# EAGLE design ESC-simple_V2A[ervinedit] (EAGLE 8.6.3)
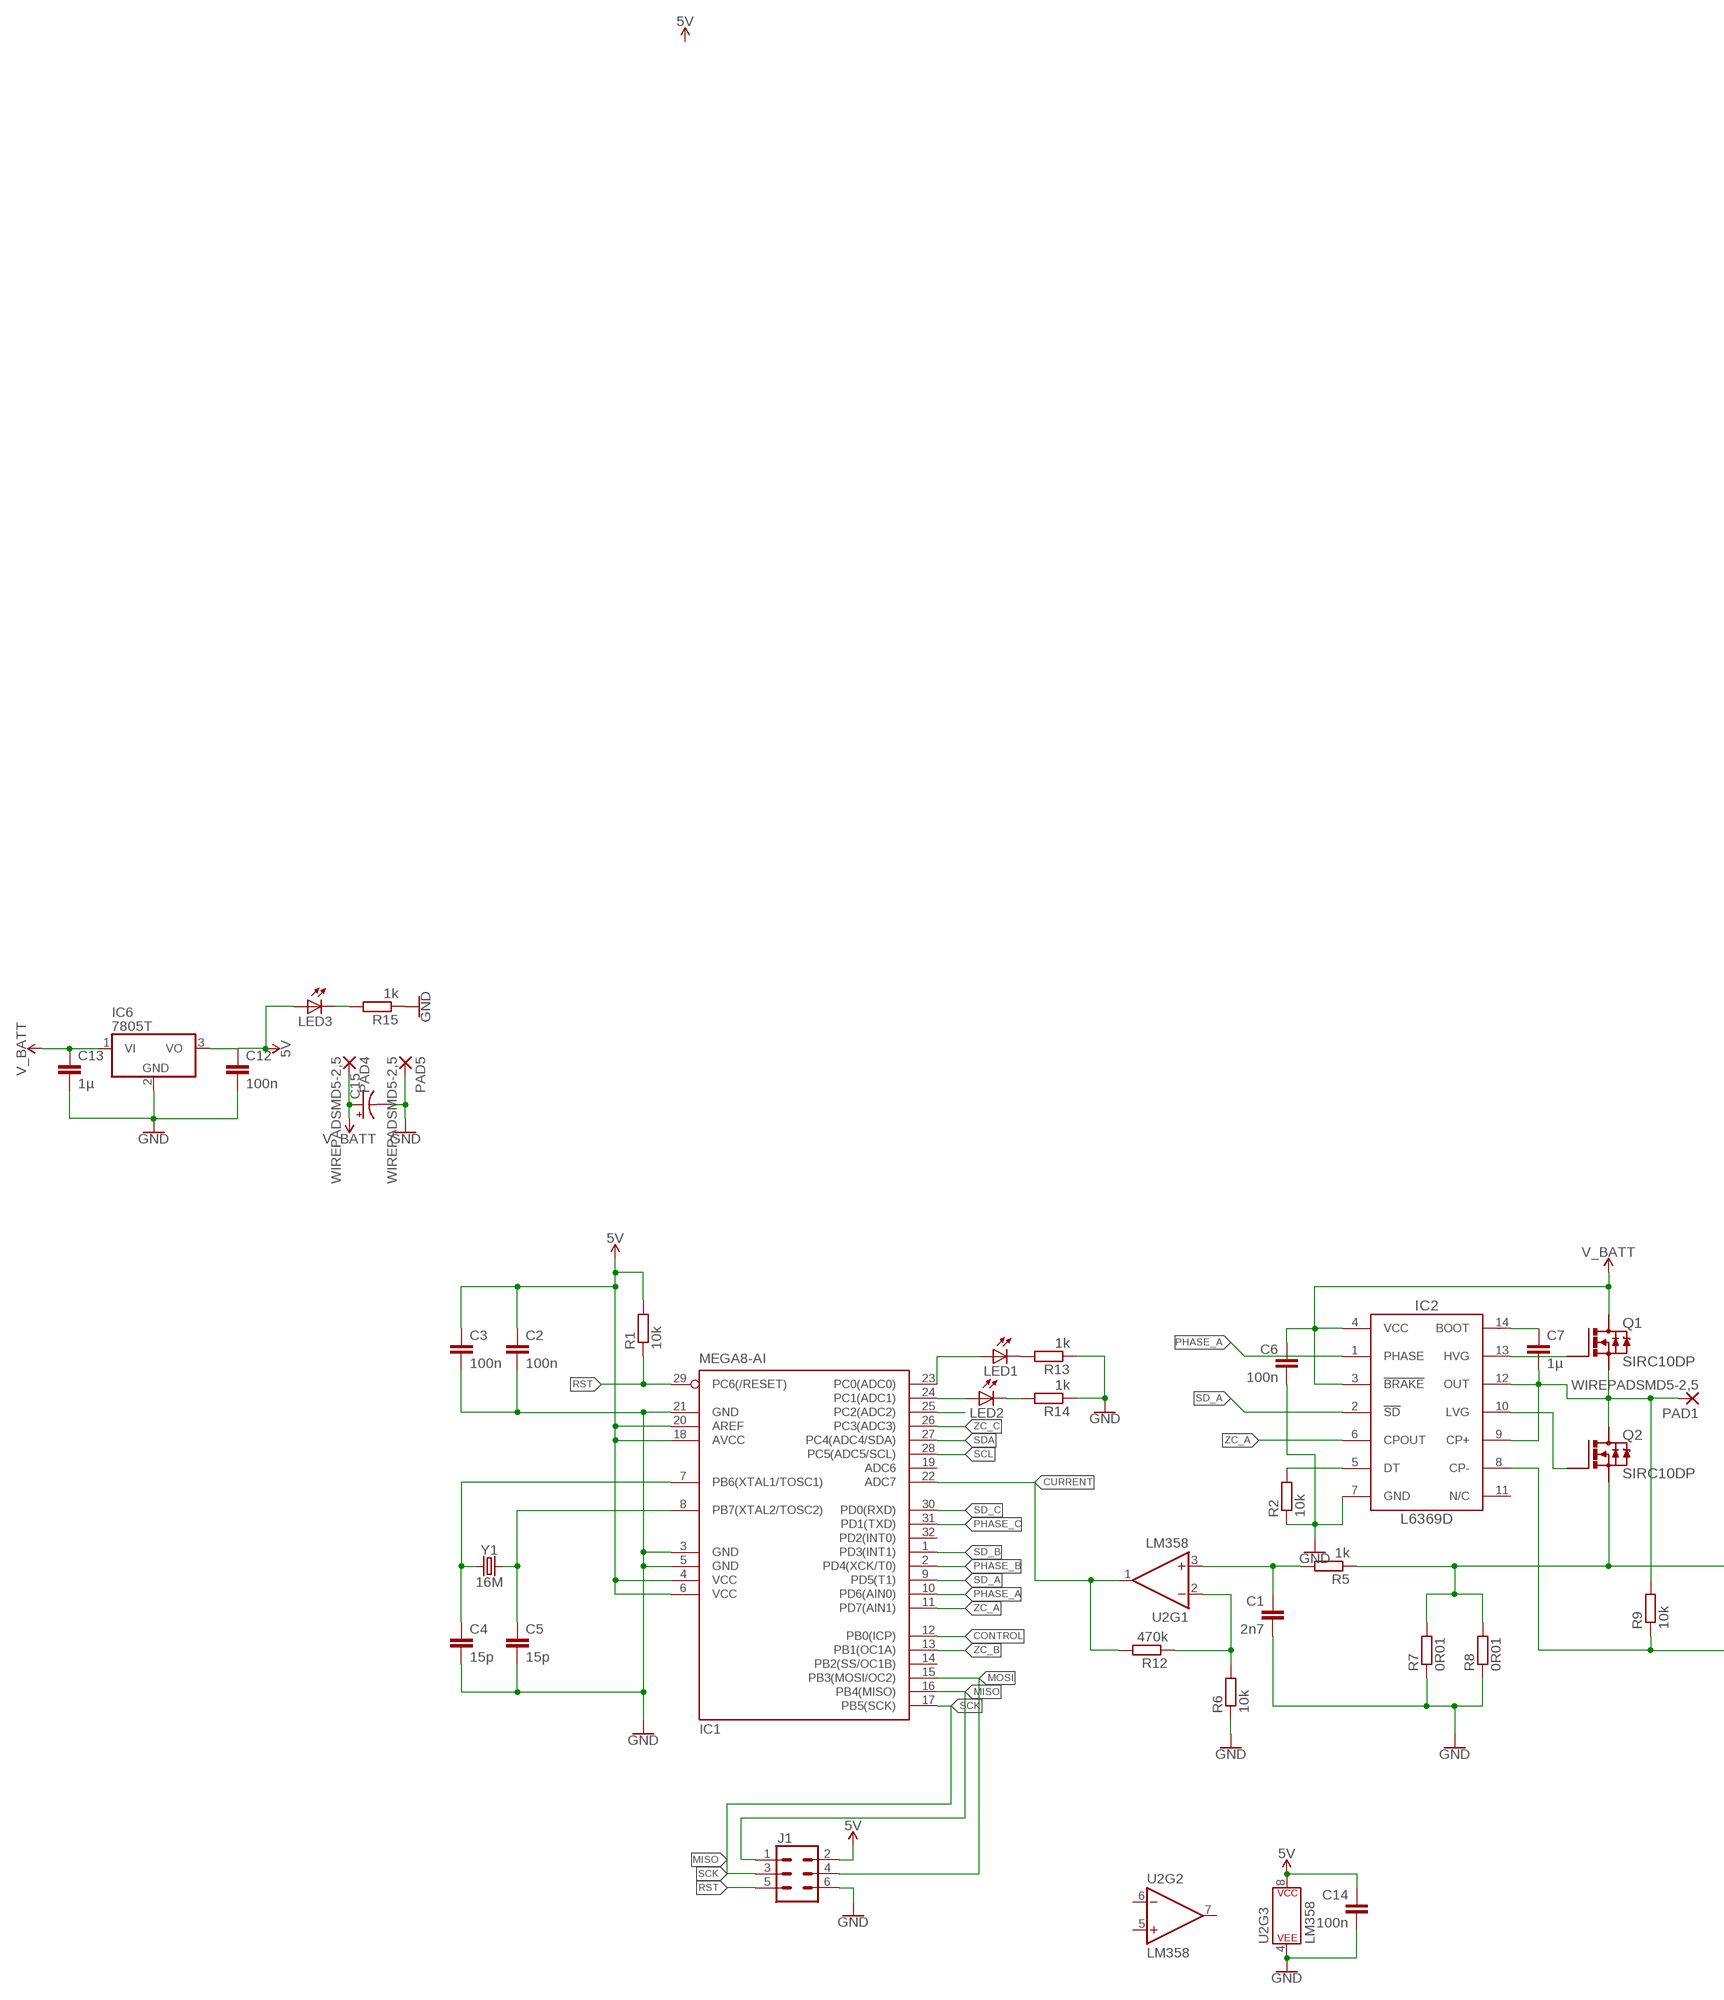
[diagram p0: schematic, sheet 1, part 1 of 2]
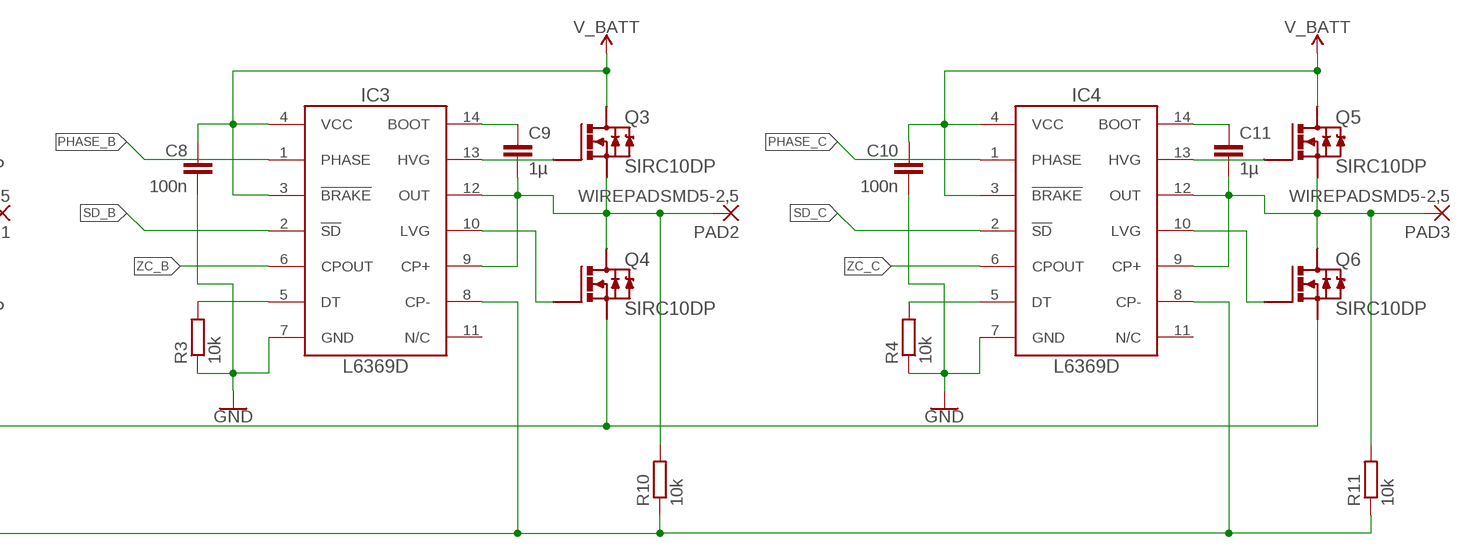
[diagram p1: schematic, sheet 1, part 2 of 2]

## Parts
C1  2n7  C-EUC1206K  [C1206K]
C2  100n  C-EUC1206K  [C1206K]
C3  100n  C-EUC1206K  [C1206K]
C4  15p  C-EUC1206K  [C1206K]
C5  15p  C-EUC1206K  [C1206K]
C6  100n  C-EUC1206K  [C1206K]
C7  1µ  C-EUC1206K  [C1206K]
C8  100n  C-EUC1206K  [C1206K]
C9  1µ  C-EUC1206K  [C1206K]
C10  100n  C-EUC1206K  [C1206K]
C11  1µ  C-EUC1206K  [C1206K]
C12  100n  C-EUC1206K  [C1206K]
C13  1µ  C-EUC1206K  [C1206K]
C14  100n  C-EUC1206K  [C1206K]
C15  CPOL-USE5-13  [E5-13]
IC1  MEGA8-AI  [TQFP32-08]
IC2  L6369D  [SO-14]
IC3  L6369D  [SO-14]
IC4  L6369D  [SO-14]
IC6  7805T  [TO220H]
J1  CONN_03X22X3_SILK_MALE_PTH  [2X3]
LED1  TLLR4400  [LED3MM]
LED2  TLLR4400  [LED3MM]
LED3  TLLR4400  [LED3MM]
PAD1  WIREPADSMD5-2,5  [5-2,5]
PAD2  WIREPADSMD5-2,5  [5-2,5]
PAD3  WIREPADSMD5-2,5  [5-2,5]
PAD4  WIREPADSMD5-2,5  [5-2,5]
PAD5  WIREPADSMD5-2,5  [5-2,5]
Q1  SIRC10DP  [POWERPAK_SO-8_SINGLE]
Q2  SIRC10DP  [POWERPAK_SO-8_SINGLE]
Q3  SIRC10DP  [POWERPAK_SO-8_SINGLE]
Q4  SIRC10DP  [POWERPAK_SO-8_SINGLE]
Q5  SIRC10DP  [POWERPAK_SO-8_SINGLE]
Q6  SIRC10DP  [POWERPAK_SO-8_SINGLE]
R1  10k  R-EU_R1206  [R1206]
R2  10k  R-EU_R1206  [R1206]
R3  10k  R-EU_R1206  [R1206]
R4  10k  R-EU_R1206  [R1206]
R5  1k  R-EU_R1206  [R1206]
R6  10k  R-EU_R1206  [R1206]
R7  0R01  R-EU_R1206  [R1206]
R8  0R01  R-EU_R1206  [R1206]
R9  10k  R-EU_R1206  [R1206]
R10  10k  R-EU_R1206  [R1206]
R11  10k  R-EU_R1206  [R1206]
R12  470k  R-EU_R1206  [R1206]
R13  1k  R-EU_R1206  [R1206]
R14  1k  R-EU_R1206  [R1206]
R15  1k  R-EU_R1206  [R1206]
U2  LM358  [DIP08]
Y1  16M  CRYSTALSMD-HC49UP  [HC49UP]

## Nets
5V [power]: C2.1 C3.1 C12.1 C14.1 IC1.4(VCC) IC1.6(VCC) IC1.18(AVCC) IC1.20(AREF) IC6.3(VO) J1.2 LED3.A R1.2 U2.8(P$V+)
A: C7.2 IC2.9(CP+) IC2.12(OUT) PAD1.1(P) Q1.1(S) Q1.2(S) Q1.3(S) Q2.5(D) Q2.6(D) Q2.7(D) Q2.8(D) Q2.9(D) R9.2
B: C9.2 IC3.9(CP+) IC3.12(OUT) PAD2.1(P) Q3.1(S) Q3.2(S) Q3.3(S) Q4.5(D) Q4.6(D) Q4.7(D) Q4.8(D) Q4.9(D) R10.2
C: C11.2 IC4.9(CP+) IC4.12(OUT) PAD3.1(P) Q5.1(S) Q5.2(S) Q5.3(S) Q6.5(D) Q6.6(D) Q6.7(D) Q6.8(D) Q6.9(D) R11.2
CONTROL: IC1.12(PB0(ICP))
CURRENT: IC1.22(ADC7) R12.2 U2.1(OUT)
CURRENT_SENSE: Q2.1(S) Q2.2(S) Q2.3(S) Q4.1(S) Q4.2(S) Q4.3(S) Q6.1(S) Q6.2(S) Q6.3(S) R5.1 R7.2 R8.2
GND: C1.2 C2.2 C3.2 C4.2 C5.2 C6.2 C8.2 C10.2 C12.2 C13.2 C14.2 C15.- IC1.3(GND) IC1.5(GND) IC1.21(GND) IC2.7(GND) IC3.7(GND) IC4.7(GND) IC6.2(GND) J1.6 PAD5.1(P) R2.1 R3.1 R4.1 R6.1 R7.1 R8.1 R13.1 R14.1 R15.1 U2.4(P$V-)
MISO: IC1.16(PB4(MISO)) J1.1
MOSI: IC1.15(PB3(MOSI/OC2)) J1.4
N$1: C7.1 IC2.14(BOOT)
N$2: IC2.13(HVG) Q1.4(G)
N$3: IC2.10(LVG) Q2.4(G)
N$4: IC3.5(DT) R3.2
N$5: IC2.5(DT) R2.2
N$6: C9.1 IC3.14(BOOT)
N$7: IC3.13(HVG) Q3.4(G)
N$8: IC3.10(LVG) Q4.4(G)
N$9: R6.2 R12.1 U2.2(-IN)
N$10: IC4.5(DT) R4.2
N$11: C11.1 IC4.14(BOOT)
N$12: IC4.13(HVG) Q5.4(G)
N$13: IC4.10(LVG) Q6.4(G)
N$14: LED1.K(C) R13.2
N$15: IC1.24(PC1(ADC1)) LED2.A
N$16: LED2.K(C) R14.2
N$17: IC1.23(PC0(ADC0)) LED1.A
N$18: LED3.K(C) R15.2
N$20: C1.1 R5.2 U2.3(+IN)
PC2: IC1.25(PC2(ADC2))
PHASE_A: IC1.10(PD6(AIN0)) IC2.1(PHASE)
PHASE_B: IC1.2(PD4(XCK/T0)) IC3.1(PHASE)
PHASE_C: IC1.31(PD1(TXD)) IC4.1(PHASE)
RST: IC1.29(PC6(/RESET)) J1.5 R1.1
SCK: IC1.17(PB5(SCK)) J1.3
SCL: IC1.28(PC5(ADC5/SCL))
SD_A: IC1.9(PD5(T1)) IC2.2(!SD)
SD_B: IC1.1(PD3(INT1)) IC3.2(!SD)
SD_C: IC1.30(PD0(RXD)) IC4.2(!SD)
SDA: IC1.27(PC4(ADC4/SDA))
V_BATT [power]: C6.1 C8.1 C10.1 C13.1 C15.+ IC2.3(!BRAKE) IC2.4(VCC) IC3.3(!BRAKE) IC3.4(VCC) IC4.3(!BRAKE) IC4.4(VCC) IC6.1(VI) PAD4.1(P) Q1.5(D) Q1.6(D) Q1.7(D) Q1.8(D) Q1.9(D) Q3.5(D) Q3.6(D) Q3.7(D) Q3.8(D) Q3.9(D) Q5.5(D) Q5.6(D) Q5.7(D) Q5.8(D) Q5.9(D)
V_NEUTRAL: IC2.8(CP-) IC3.8(CP-) IC4.8(CP-) R9.1 R10.1 R11.1
XTAL1: C4.1 IC1.7(PB6(XTAL1/TOSC1)) Y1.1
XTAL2: C5.1 IC1.8(PB7(XTAL2/TOSC2)) Y1.2
ZC_A: IC1.11(PD7(AIN1)) IC2.6(CPOUT)
ZC_B: IC1.13(PB1(OC1A)) IC3.6(CPOUT)
ZC_C: IC1.26(PC3(ADC3)) IC4.6(CPOUT)
Unconnected: IC1.14(PB2(SS/OC1B)) IC1.19(ADC6) IC1.32(PD2(INT0)) IC2.11(N/C) IC3.11(N/C) IC4.11(N/C) U2.5(+IN) U2.6(-IN) U2.7(OUT)

## Library data of the parts
C1-C14 = rcl:C-EU: CAPACITOR, European symbol; SPICEPREFIX: C
C15 = rcl:CPOL-US: POLARIZED CAPACITOR, American symbol; SPICEPREFIX: C
IC1 = atmel:MEGA8: MICROCONTROLLER 8 Kbytes FLASH, 1 kbytes SRAM, 512 bytes EEPROM, USART, 6-channel 10 bit ADC, 2-channel 8 bit ADC Pin compatible with Atmega48, ATMega88, ATMega168 Source: avr.lbr; MPN: ATMEGA8-16AU; OC_FARNELL: 9171371; OC_NEWARK: 73M8863
IC2-IC4 = custom-ics:L6369
IC6 = linear:78*: Positive VOLTAGE REGULATOR Source: http://cache.national.com/ds/LM/LM78L05.pdf http://www.fairchildsemi.com/ds/LM/LM7805.pdf
J1 = SparkFun-Connectors:CONN_03X2: Multi connection point. Often used as Generic Header-pin footprint for 0.1 inch spaced/style header connections You can populate with any combo of single row headers, but if you'd like an exact match, check these: Header - 2x3 (Male, 0.1") <https://www.sparkfun.com/products/12807> (PRT-12807) Header - 2x3 (Female, 0.1") <https://www.sparkfun.com/products/13010> (PRT-13010) 2x3 Pin Shrouded Header <https://www.sparkfun.com/products/10877> (PRT-10877) On any of the 0.1 inch spaced packages, you can populate with these: Break Away Headers - Straight <https://www.sparkfun.com/products/116> (PRT-00116) Break Away Male Headers - Right Angle <https://www.sparkfun.com/products/553> (PRT-00553) Female Headers <https://www.sparkfun.com/products/115> (PRT-00115) Break Away Headers - Machine Pin <https://www.sparkfun.com/products/117> (PRT-00117) Break Away Female Headers - Swiss Machine Pin <https://www.sparkfun.com/products/743> (PRT-00743) Special note: the shrouded connector mates well with our 3x2 ribbon cables: Ribbon Crimp Connector - 6-pin (2x3, Female) <https://www.sparkfun.com/products/10651> (PRT-10651) Ribbon Cable - 6 wire (15ft) <https://www.sparkfun.com/products/10646> (PRT-10646); PROD_ID: CONN-09701
LED1-LED3 = led:TLLR4400: Low Current (2mA) LED 3 mm Tinted Diffused Package color RED Source: Data sheet <http://www.farnell.com/datasheets/391100.pdf>; MF: VISHAY SEMICONDUCTOR; OC_FARNELL: 1612437
PAD1-PAD5 = wirepad:WIREPAD: Wire PAD connect wire on PCB
Q1-Q6 = MOSFET:SIRC10DP: N-Channel 30 V (D-S) MOSFET with Schottky Diode Datasheet <https://www.vishay.com/docs/75189/sirc10dp.pdf>
R1-R15 = rcl:R-EU_: RESISTOR, European symbol; SPICEPREFIX: R
U2 = SparkFun-IC-Amplifiers:LM358: LM358 Jellybean op-amp Datasheet <http://www.sparkfun.com/datasheets/Components/General/LM358.pdf> SparkFun Products Op-Amp (Thru-Hole) - LM358 <https://www.sparkfun.com/products/9456> (COM-09456); PROD_ID: IC-09172
Y1 = SparkFun-Clocks:CRYSTAL: Crystals (Generic) These are passive quartz crystals, which can be used as a clock source for a microcontroller. Crystal's are two-terminal devices. They require external "load" capacitors to generate an oscillating signal.

## Net classes
0 default: width 0.305 mm, clearance 0.305 mm
1 power: width 0.305 mm, clearance 0.305 mm

## Board
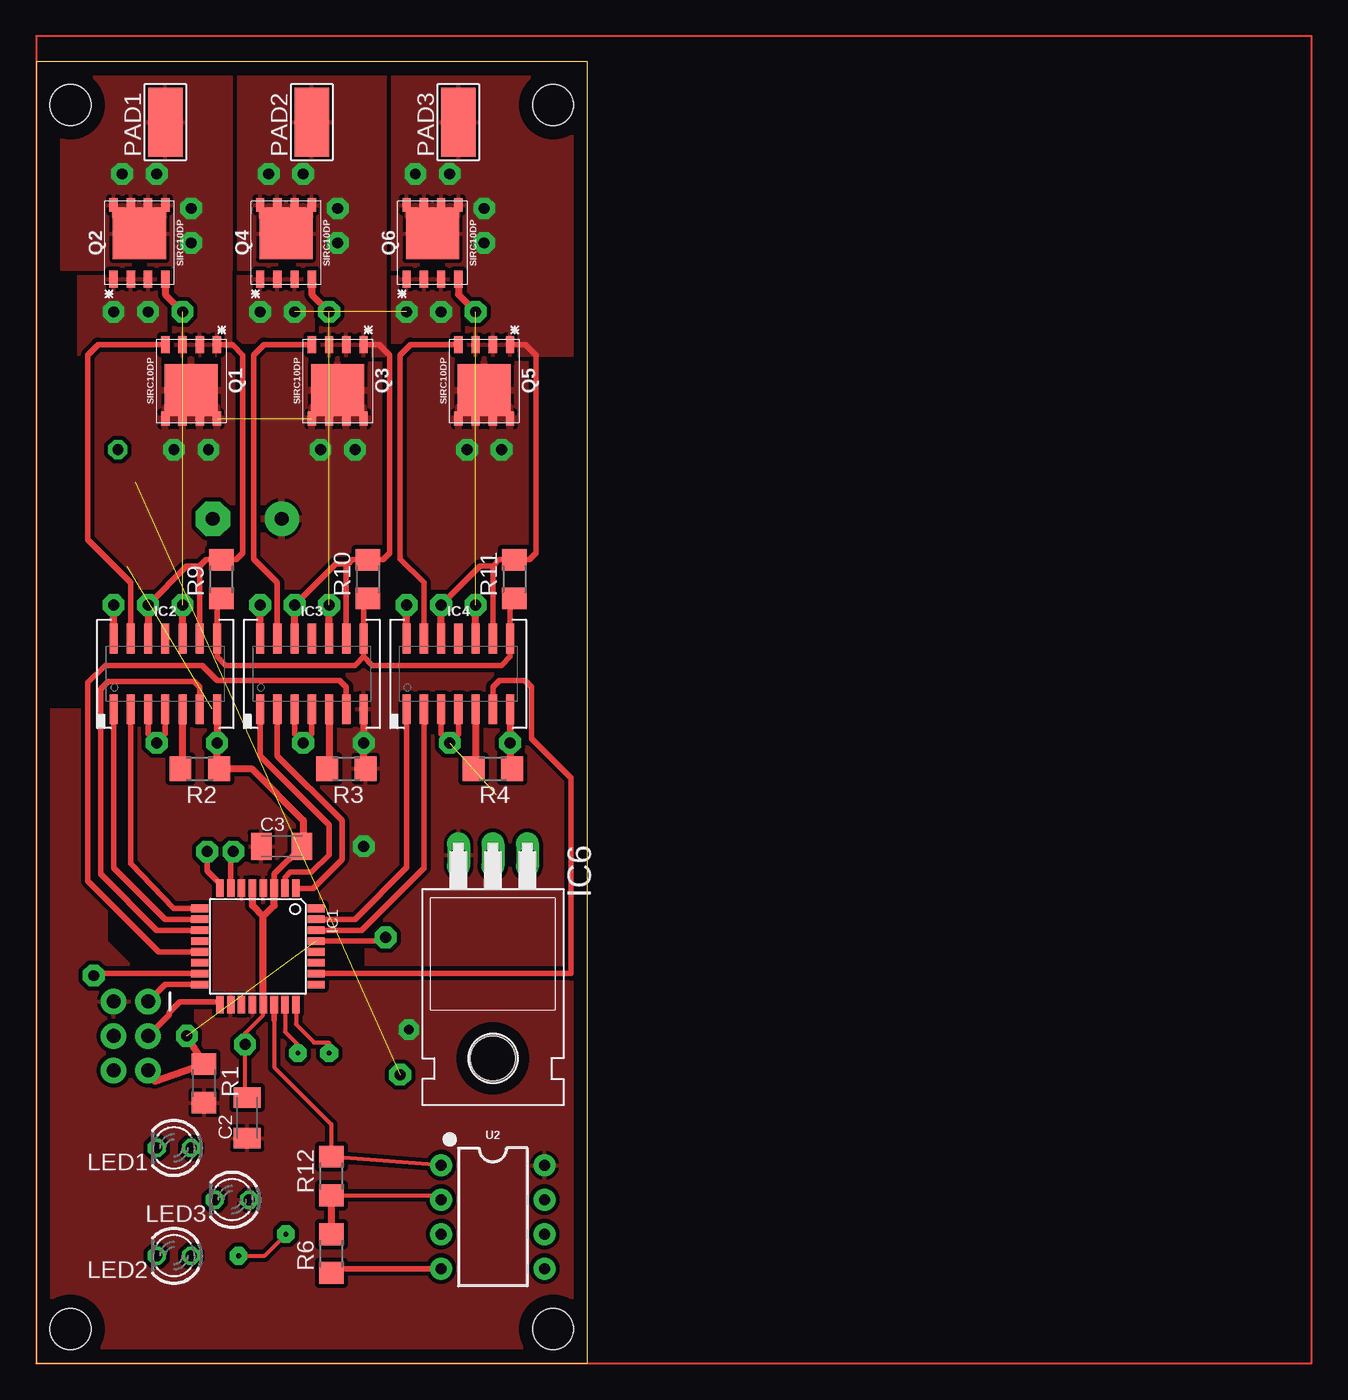
[diagram p2: board, top side]
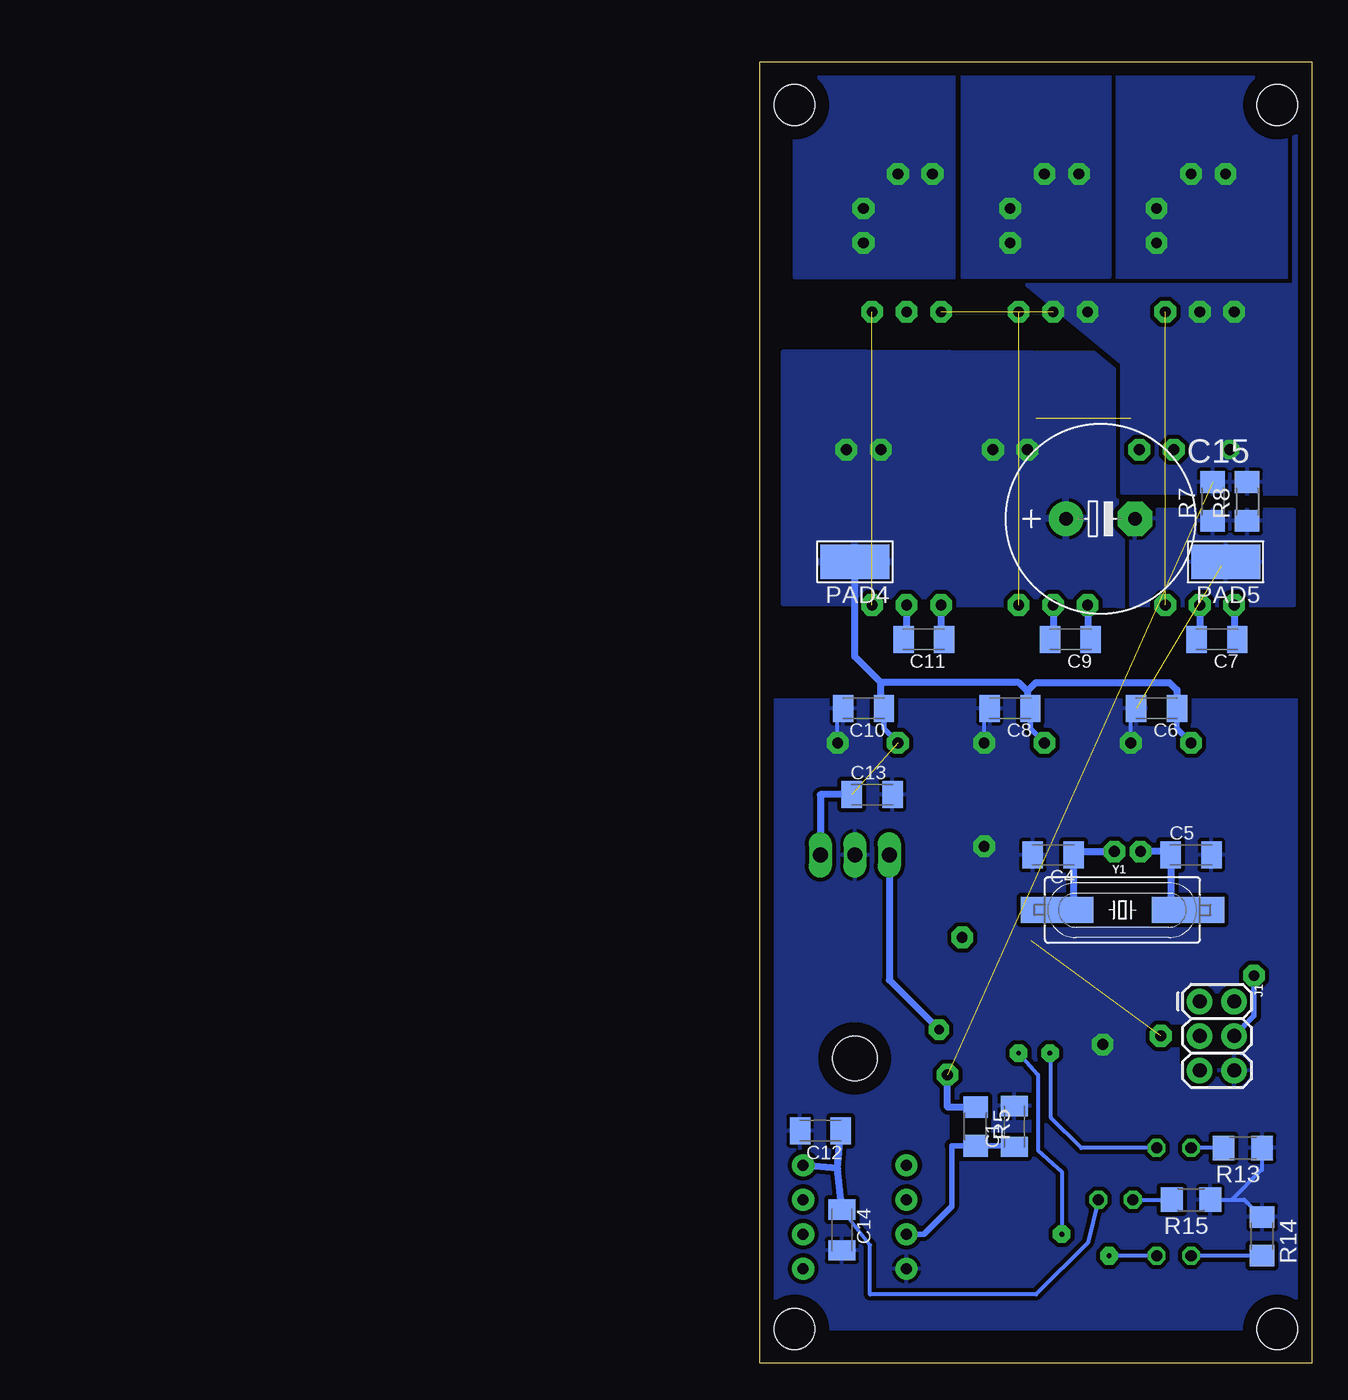
[diagram p3: board, bottom side, seen from below]

Size 40.64 x 95.89 mm. Coordinates in mm from the lower left corner, seen from the top.
Outline: 0,0 40.64,0 40.64,95.89 0,95.89 0,0
Copper layers (1*16): Top 0.035mm / dielectric 1.5mm / Bottom 0.035mm
Design rules "default": minimum track width 6mil, minimum drill 0.35mm, track to track 6mil, track to pad 6mil, pad to pad 6mil, via to via 6mil, smd to smd 6mil, copper to edge 40mil, drill to drill 6mil, minimum pad ring 10mil, minimum via ring 8mil, stop-mask expansion 4mil, vias tented up to drill 0mil, thermal gap 10mil
Holes 3 mm at 2.54,2.54 38.1,2.54 2.54,92.71 38.1,92.71
tRestrict: area 7.6,25.4 to 11.4,26.7; area 6.3,55.9 to 11.4,56.5; area 28.4,80.5 to 29.8,81.3; area 17.9,80.6 to 19.1,81.3; area 7.1,80.6 to 8.1,81.3; area 5.4,29.1 to 11.3,33.3; area 21.6,29.2 to 24.1,30.5; area 5.2,27.1 to 7.5,28.1
bRestrict: area 6.3,23.5 to 10.2,24.8; area 7.6,22.2 to 9.5,23.5; area 10.8,47 to 12.1,49.5; area 10.8,32.2 to 17.6,37.3; area 24.1,17 to 26.7,17.8; area 23.7,17 to 24.3,17.9; area 25.9,16.4 to 26.7,18.4; area 23,14.9 to 23.8,15.4; area 23,16.4 to 23.7,17

### Footprints (pad centres in the part's own frame; a part is rotated, then mirrored left to right if it is on the bottom)
C1206K = smd 1.5 x 2: 1 -1.5,0; 2 1.5,0
E5-13 = drill 1.016 pad 2.54: + -2.54,0 | drill 1.016 pad 2.54 octagon: - 2.54,0
TQFP32-08 = smd 1.27 x 0.559: 1 -4.293,2.8; 2 -4.293,2; 3 -4.293,1.2; 4 -4.293,0.4; 5 -4.293,-0.4; 6 -4.293,-1.2; 7 -4.293,-2; 8 -4.293,-2.8; 17 4.293,-2.8; 18 4.293,-2; 19 4.293,-1.2; 20 4.293,-0.4; 21 4.293,0.4; 22 4.293,1.2; 23 4.293,2; 24 4.293,2.8 | smd 0.559 x 1.27: 9 -2.8,-4.293; 10 -2,-4.293; 11 -1.2,-4.293; 12 -0.4,-4.293; 13 0.4,-4.293; 14 1.2,-4.293; 15 2,-4.293; 16 2.8,-4.293; 25 2.8,4.293; 26 2,4.293; 27 1.2,4.293; 28 0.4,4.293; 29 -0.4,4.293; 30 -1.2,4.293; 31 -2,4.293; 32 -2.8,4.293
SO-14 = smd 0.6 x 2.2: 1 -3.81,-2.6; 2 -2.54,-2.6; 3 -1.27,-2.6; 4 0,-2.6; 5 1.27,-2.6; 6 2.54,-2.6; 7 3.81,-2.6; 8 3.81,2.6; 9 2.54,2.6; 10 1.27,2.6; 11 0,2.6; 12 -1.27,2.6; 13 -2.54,2.6; 14 -3.81,2.6
TO220H = drill 1.118 long: 1 -2.54,-10.16; 2 0,-10.16; 3 2.54,-10.16 | hole 3.302: 0,4.826
2X3 = drill 1.016 pad 1.88: 1 0,0; 2 0,2.54; 3 2.54,0; 4 2.54,2.54; 5 5.08,0; 6 5.08,2.54
LED3MM = drill 0.813 octagon: A -1.27,0; K 1.27,0
5-2,5 = smd 2.54 x 5.08: 1 0,0
POWERPAK_SO-8_SINGLE = smd 1.27 x 0.61: 1 -2.67,1.905; 2 -2.67,0.635; 3 -2.67,-0.635; 4 -2.67,-1.905 | smd 1.02 x 0.61: 5 2.795,-1.905; 6 2.795,-0.635; 7 2.795,0.635; 8 2.795,1.905 | smd 3.81 x 3.91: 9 0.69,0
R1206 = smd 1.6 x 1.803: 1 -1.422,0; 2 1.422,0
DIP08 = drill 0.813 pad 1.626: 1 -3.81,-3.81; 2 -1.27,-3.81; 3 1.27,-3.81; 4 3.81,-3.81; 5 3.81,3.81; 6 1.27,3.81; 7 -1.27,3.81; 8 -3.81,3.81
HC49UP = smd 5.334 x 1.93: 1 -4.826,0; 2 4.826,0

### Placement (x,y rotation side)
C1  21.91,17.46 90 bottom
C2  15.56,18.1 90 top
C3  18.1,38.1 0 top
C4  19.05,37.47 180 bottom
C5  8.89,37.47 0 bottom
C6  11.43,48.26 180 bottom
C7  6.98,53.34 180 bottom
C8  22.23,48.26 180 bottom
C9  17.78,53.34 180 bottom
C10  33.02,48.26 180 bottom
C11  28.57,53.34 180 bottom
C12  36.2,17.14 180 bottom
C13  32.38,41.91 0 bottom
C14  34.61,9.84 270 bottom
C15  15.56,62.23 0 bottom
IC1  16.35,30.72 270 top
IC2  9.53,50.8 0 top
IC3  20.32,50.8 0 top
IC4  31.11,50.8 0 top
IC6  33.66,27.3 180 top
J1  8.25,26.67 270 bottom
LED1  10.16,15.88 180 top
LED2  10.16,7.94 180 top
LED3  14.45,12.06 180 top
PAD1  9.53,91.44 0 top
PAD2  20.32,91.44 0 top
PAD3  31.11,91.44 0 top
PAD4  33.66,59.05 90 bottom
PAD5  6.35,59.05 90 bottom
Q1  11.43,72.39 270 top
Q2  7.62,82.55 90 top
Q3  22.23,72.39 270 top
Q4  18.42,82.55 90 top
Q5  33.02,72.39 270 top
Q6  29.21,82.55 90 top
R1  12.38,20.64 270 top
R2  12.06,43.81 180 top
R3  22.86,43.81 180 top
R4  33.66,43.81 180 top
R5  24.77,17.46 270 bottom
R6  21.75,8.1 90 top
R7  7.3,63.5 90 bottom
R8  4.76,63.5 90 bottom
R9  13.65,57.78 90 top
R10  24.45,57.78 90 top
R11  35.24,57.78 90 top
R12  21.75,13.81 90 top
R13  5.08,15.88 180 bottom
R14  3.65,9.37 270 bottom
R15  8.89,12.06 180 bottom
U2  33.66,10.79 270 top
Y1  13.94,33.41 0 bottom

### Tracks (layer width: path | path; a pad name or v marks a point on that pad's centre or on a via)
5V  (via drill 0.7 pad 1.5)
  Bottom 0.305: LED3.A 16.51,8.89 20.32,5.08 32.54,5.08 32.54,8.73 C14.1
  Bottom 0.508: C14.1 34.92,14.38 | 34.92,14.38 U2.8 | 34.92,14.38 C12.1 | IC6.3 31.11,28.26 v27.46,24.61
  pour Top (rank 4): 40,48.26 0.79,48.1 0.64,0.64 40,0.48
A  (via drill 0.8 pad 1.6)
  Top 0.305: Q2.8 5.71,85.14
  Top 0.406: Q1.1 14.47,75.06 15.24,74.3 15.24,59.69 14.76,59.21 R9.2 12.53,59.21 12.06,58.74 | IC2.9 12.06,58.74 | 12.06,58.74 11.11,58.74 v8.25,55.88
  Top 0.508: v8.25,55.88 IC2.12
  Bottom 0.305: 8.25,53.66 C7.2
  Bottom 0.508: v8.25,55.88 8.25,53.66
  other vias: 6.35,87.63 8.89,87.63 11.43,85.09 11.43,82.55
  pour Top (rank 3): 1.9,80.64 15.24,80.64 15.24,96.52 1.9,96.52
  pour Top (rank 3): 10.16,86.36 10.16,74.3 14.6,74.3 14.6,86.36
  pour Bottom (rank 2): 14.29,80.01 14.29,96.52 1.9,96.52 1.9,80.01
B  (via drill 0.8 pad 1.6)
  Top 0.305: Q4.8 16.51,85.14
  Top 0.406: Q3.1 25.27,75.06 26.04,74.3 26.04,59.69 25.55,59.21 R10.2 23.33,59.21 23.02,58.9 | IC3.9 22.86,58.74 23.02,58.9 | 23.02,58.9 22.07,58.9 v19.05,55.88
  Top 0.508: IC3.12 v19.05,55.88
  Bottom 0.305: 19.05,53.66 C9.2
  Bottom 0.508: v19.05,55.88 19.05,53.66
  other vias: 17.14,87.63 19.69,87.63 22.23,85.09 22.23,82.55
  pour Top: 20.96,74.3 25.72,74.3 25.72,96.52 14.92,96.52 14.92,80.64 20.96,80.64
  pour Bottom: 14.92,96.52 14.92,80.01 25.72,80.01 25.72,96.52
C  (via drill 0.8 pad 1.6)
  Top 0.406: Q5.1 36.06,75.06 36.83,74.3 36.83,59.69 36.35,59.21 R11.2 34.12,59.21 33.66,58.74 | IC4.9 33.66,58.74 | 33.66,58.74 32.7,58.74 v29.85,55.88
  Top 0.508: IC4.12 v29.85,55.88
  Bottom 0.305: 29.85,53.66 C11.2
  Bottom 0.508: v29.85,55.88 29.85,53.66
  other vias: 27.94,87.63 30.48,87.63 33.02,85.09 33.02,82.55
  pour Top (rank 3): 24.77,96.52 24.77,80.64 42.54,80.64 42.54,96.52
  pour Top: 31.75,74.3 31.75,86.36 41.91,86.36 41.91,74.3
  pour Bottom (rank 2): 26.35,80.01 26.35,96.52 38.1,96.52 38.1,80.01
CURRENT
  Top 0.305: 17.55,25.4 17.55,21.82 21.75,17.62 R12.2 U2.1
  Top 0.406: IC1.22 17.55,25.4 17.55,25.32
CURRENT_SENSE  (via drill 0.8 pad 1.4, 0.8 pad 1.6)  (2 unrouted)
  Bottom 0.508: R5.1 26.84,18.88 v26.83,21.27
  other vias: 8.25,77.47 19.05,77.47 29.85,77.47 5.71,77.47 16.51,77.47 27.3,77.47 6.03,67.31
  pour Bottom (rank 3): 13.97,64.14 13.97,73.66 40,95.09 -1.91,95.09 -3.02,63.98
  pour Top (rank 2): 14.92,80.64 20.96,80.64 20.96,75.25 14.92,75.25
  pour Top (rank 4): 3.18,80.64 9.53,80.64 9.53,74.3 3.18,74.3
  pour Top (rank 2): 25.4,80.01 31.11,80.01 31.11,75.25 25.4,75.25
GND  (via drill 0.8 pad 1.6)  (1 unrouted)
  Top 0.305: R2.1 13.33,44.13 | R3.1 24.13,44.13 | 34.92,44.13 R4.1 | C2.2 15.4,19.76 v15.4,23.5 15.4,24.32 16.68,25.6 16.68,26.36 IC1.21
  Top 0.406: C3.2 17.55,36.05 IC1.3 | U2.4 21.75,6.99 R6.1
  Top 0.508: IC2.7 v13.33,45.72 13.33,44.13 | IC3.7 v24.13,45.72 24.13,44.13 | IC4.7 v34.92,45.72 34.92,44.13 | IC1.21 16.75,32.94 | IC1.3 17.55,33.74 16.75,32.94 | 16.75,32.94 15.94,33.74 IC1.5 | R2.1 15.87,43.81 19.69,40.01 19.69,38.19 C3.2
  Bottom 0.305: v13.33,45.72 13.33,47.3 C6.2 | v24.13,45.72 24.13,47.3 C8.2 | v34.92,45.72 34.92,47.3 C10.2 | R15.1 5.89,12.06 | 5.89,12.06 3.71,14.25 arc-90 3.66,14.3 R13.1 | 5.89,12.06 4.98,12.06 3.71,10.79 R14.1
  Bottom 0.508: 6.66,58.74 PAD5.1
  other vias: 24.13,38.1
  pour Bottom: 1.27,62.87 13.33,62.87 13.33,55.88 1.27,55.88
  pour Top: 20.96,31.75 24.13,31.75 28.57,36.2 28.57,47.62 29.85,48.9 33.66,48.9 34.92,50.16 34.92,51.44 34.29,52.07 19.05,52.07 20.96,51.44
  pour Bottom: 0,2.54 40.64,2.54 40.64,48.9 0,48.9
MISO
  Top 0.305: IC1.16 12.03,27.94
  Top 0.406: IC1.16 9.5,27.92 J1.1
MOSI  (via drill 0.8 pad 1.6)
  Top 0.406: IC1.15 4.4,28.72 v4.26,28.57
  Bottom 0.406: v4.26,28.57 4.26,25.59 J1.4
N$1  (via drill 0.8 pad 1.6)
  Top 0.508: IC2.14 v5.71,55.88
  Bottom 0.305: 5.71,53.66 C7.1
  Bottom 0.508: v5.71,55.88 5.71,53.66
N$2
  Top 0.406: Q1.4 4.57,75.06 3.81,74.3 3.81,60.69 6.98,57.52 IC2.13
N$3  (via drill 0.8 pad 1.6)  (1 unrouted)
  Top 0.508: IC2.10 v10.79,55.88 | Q2.4 9.53,78.74 v10.79,77.47
N$4
  Top 0.305: 21.59,44.13 R3.2
  Top 0.508: IC3.5 21.59,44.13
N$5
  Top 0.305: R2.2 10.79,44.13
  Top 0.508: 10.79,44.13 IC2.5
N$6  (via drill 0.8 pad 1.6)
  Top 0.508: IC3.14 v16.51,55.88
  Bottom 0.305: 16.51,53.66 C9.1
  Bottom 0.508: v16.51,55.88 16.51,53.66
N$7
  Top 0.406: Q3.4 16.8,75.06 16.03,74.3 16.03,59.26 17.78,57.52 IC3.13
N$8  (via drill 0.8 pad 1.6)  (1 unrouted)
  Top 0.508: IC3.10 v21.59,55.88 | Q4.4 20.32,78.74 v21.59,77.47
N$9
  Top 0.305: R12.1 29.85,12.39 U2.2
  Top 0.508: R12.1 R6.2
N$10
  Top 0.305: 32.38,44.13 R4.2
  Top 0.508: IC4.5 32.38,44.13
N$11  (via drill 0.8 pad 1.6)
  Top 0.508: IC4.14 v27.3,55.88
  Bottom 0.305: 27.3,53.66 C11.1
  Bottom 0.508: v27.3,55.88 27.3,53.66
N$12
  Top 0.406: Q5.4 27.59,75.06 26.83,74.3 26.83,59.26 28.57,57.52 IC4.13
N$13  (via drill 0.8 pad 1.6)  (1 unrouted)
  Top 0.508: IC4.10 v32.38,55.88 | Q6.4 31.11,78.74 v32.38,77.47
N$14
  Bottom 0.305: R13.2 LED1.K
N$15  (via drill 0.35 pad 1.3)
  Top 0.305: v14.92,7.94 16.83,7.94 v18.42,9.53 | IC1.24 19.14,24.99 20.48,23.65 21.59,23.65 v21.59,22.86
  Bottom 0.305: LED2.A v14.92,7.94 | v21.59,22.86 20.16,21.27 20.16,15.72 18.42,14.13 v18.42,9.53
N$16
  Bottom 0.305: R14.2 arc90 R14.2 LED2.K
N$17  (via drill 0.35 pad 1.3)
  Top 0.305: IC1.23 18.35,24.44 19.29,23.5 v19.29,22.86
  Bottom 0.305: v19.29,22.86 19.21,22.86 19.21,18.1 16.99,15.88 LED1.A
N$18
  Bottom 0.305: LED3.K R15.2
N$19
  Top 0.152: 0,97.79 0,0 93.98,0 93.98,97.79 0,97.79
N$20
  Bottom 0.406: U2.3 28.57,9.53 26.51,11.59 26.51,16.03 26.5,16.04 R5.2 21.99,16.04 C1.1
PHASE_A
  Top 0.406: IC1.10 9.51,32.72 5.71,36.51 IC2.1
PHASE_B
  Top 0.406: IC1.2 18.35,35.81 18.73,36.2 20.32,36.2 21.59,37.47 21.59,39.69 16.51,44.77 IC3.1
PHASE_C
  Top 0.406: IC4.1 27.3,36.53 23.5,32.72 IC1.31
RST  (via drill 0.8 pad 1.6)  (1 unrouted)
  Top 0.406: IC1.29 25.38,31.12 v25.75,31.38
  Top 0.508: v11.11,24.13 R1.1 8.72,20.79 J1.5
SCK
  Top 0.305: 13.3,26.67 13.32,26.65 IC1.17
  Top 0.406: J1.3 9.8,25.67 9.8,25.88 10.57,26.65 13.32,26.65
SD_A
  Top 0.406: IC1.9 10.14,33.52 6.98,36.83 IC2.2
SD_B
  Top 0.406: IC3.2 17.78,44.77 22.54,40.01 22.54,37.15 20.41,35.01 IC1.1
SD_C
  Top 0.406: IC1.30 23.98,31.92 28.57,36.51 IC4.2
V_BATT  (via drill 0.8 pad 1.6)  (2 unrouted)
  Top 0.406: IC2.4 9.53,46.35 v8.89,45.72 8.25,46.35 IC2.3 | IC3.3 19.05,46.35 v19.69,45.72 20.32,46.35 IC3.4 | IC4.3 29.85,46.35 v30.48,45.72 31.11,46.35 IC4.4
  Bottom 0.406: C6.1 9.93,46.76 v8.89,45.72 | C8.1 20.73,46.76 v19.69,45.72 | C10.1 31.52,46.76 v30.48,45.72
  Bottom 0.508: PAD4.1 33.66,52.07 31.75,50.16 | 20.96,49.53 21.59,50.16 31.75,50.16 | 20.96,49.53 20.33,50.16 10.48,50.16 9.93,49.62 C6.1 | C10.1 31.75,48.49 31.75,50.16 | 20.96,49.53 20.96,48.49 C8.1 | C13.1 36.2,41.91 IC6.1
  other vias: 10.16,67.31 12.7,67.31 20.96,67.31 23.5,67.31 31.75,67.31 34.29,67.31
  pour Bottom (rank 4): 8.25,74.3 38.89,74.45 38.89,56.04 8.25,55.88
  pour Top (rank 2): -1.27,74.93 41.91,74.93 41.91,55.88 -1.27,55.88
V_NEUTRAL
  Top 0.305: 34.92,56.05 R11.1 | 13.33,56.05 R9.1 | 24.13,56.05 R10.1
  Top 0.406: 24.13,52.07 23.5,51.44 13.97,51.44 13.33,52.07 IC2.8 13.33,56.05 | 24.13,52.07 IC3.8 24.13,56.05 | 24.13,52.07 24.77,51.44 34.29,51.44 34.92,52.07 IC4.8 34.92,56.05
XTAL1  (via drill 0.8 pad 1.6)
  Top 0.406: IC1.7 14.35,37.52 v14.53,37.71
  Bottom 0.508: v14.53,37.71 17.3,37.71 C4.1 17.55,33.88 18.03,33.41 Y1.1
XTAL2  (via drill 0.8 pad 1.6)
  Top 0.406: IC1.8 13.54,35.35 12.61,36.28 v12.61,37.71
  Bottom 0.508: v12.61,37.71 10.63,37.71 C5.1 10.39,33.88 9.91,33.41 Y1.2
ZC_A
  Top 0.406: IC2.6 12.06,49.85 11.66,50.25 5.33,50.25 4.76,49.68 4.76,36.05 8.89,31.92 IC1.11
ZC_B
  Top 0.406: IC3.6 22.86,49.85 22.38,50.32 13.33,50.32 12.22,51.44 5.08,51.44 3.81,50.16 3.81,35.56 9.04,30.33 12.04,30.33 IC1.13
ZC_C
  Top 0.406: IC4.6 33.66,49.85 34.13,50.32 36.04,50.32 36.51,49.85 36.51,46.04 39.42,43.13 39.42,28.73 21.48,28.73 20.65,28.73 IC1.26